# Altium project ELE_MODULE.PrjPcb
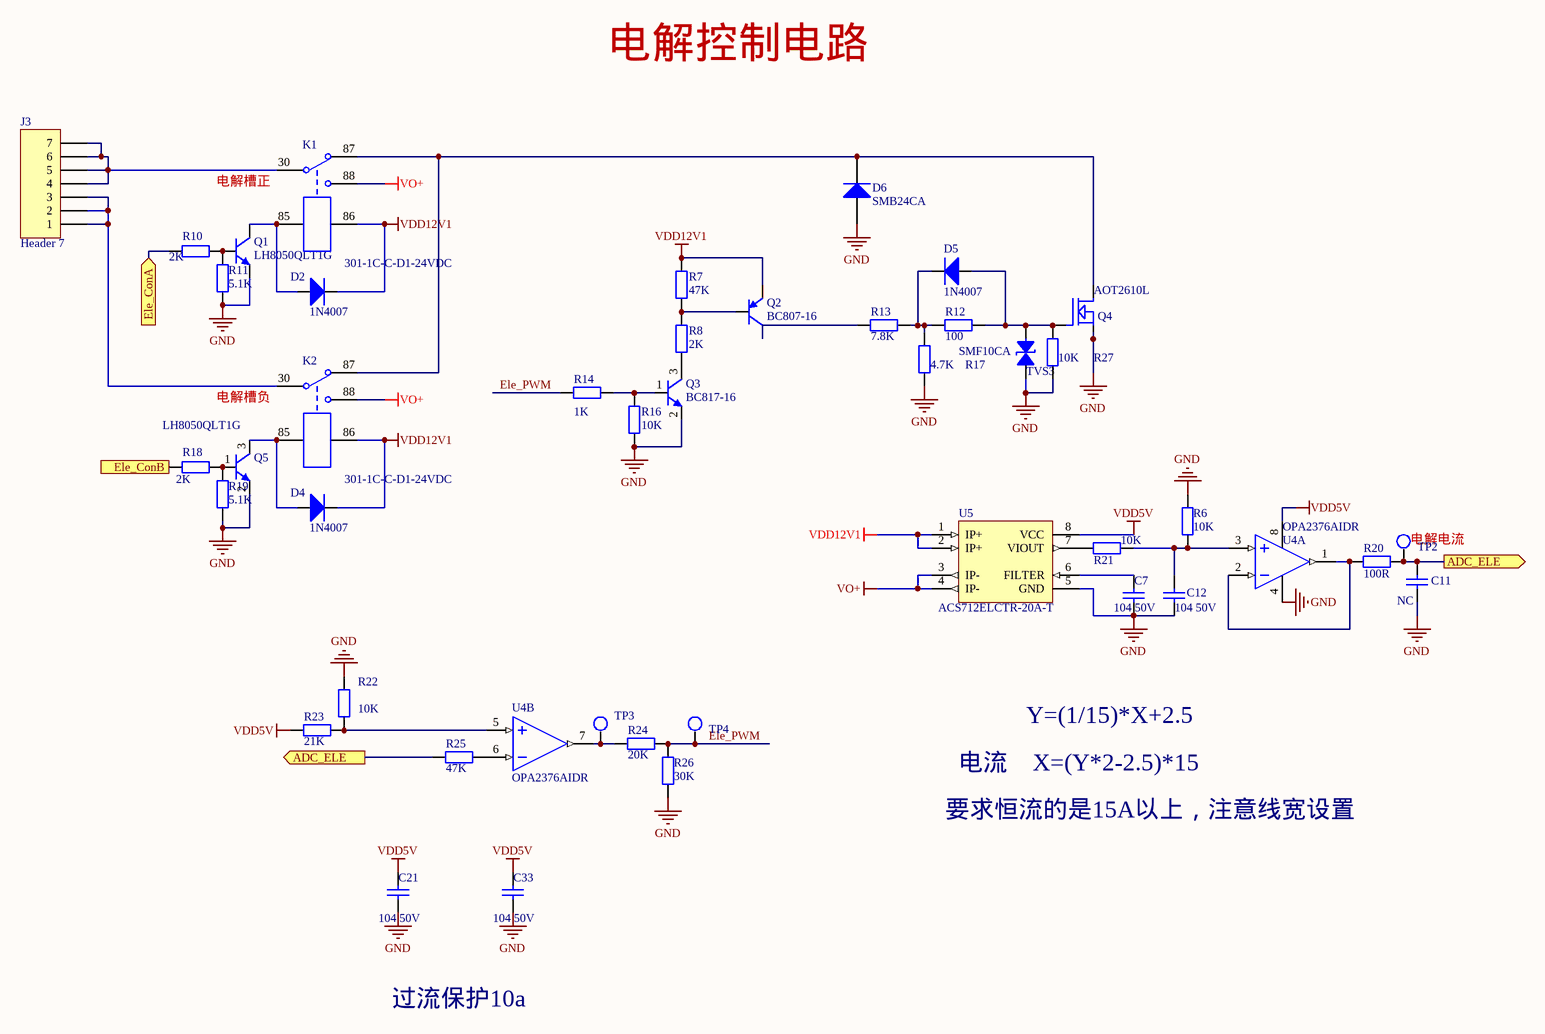
[diagram p0: 07_EL_CON.SchDoc]
2 sheets, 57 parts. Net scope: global (net labels, ports and power ports of the same name join across sheets).
Board file: PCB1.PcbDoc
Sheets:
  07_EL_CON.SchDoc
  com.SchDoc

## Sheet 07_EL_CON.SchDoc
size A3

### Parts
C7  104 50V  [SMD-0603C]
C11  NC  [SMD-0603C]
C12  104 50V  [SMD-0603C]
C21  104 50V  [SMD-0603C]
C33  104 50V  [SMD-0603C]
D2  1N4007  [DO-214-AC]
D4  1N4007  [DO-214-AC]
D5  1N4007  [DO-214-AC]
D6  SMB24CA  [SMB]
J3  Header 7  [VH-AW-3.96*7P]
K1  301-1C-C-D1-24VDC  [301-1C-C-R1-24VDC]
K2  301-1C-C-D1-24VDC  [301-1C-C-R1-24VDC]
Q1  LH8050QLT1G  [SOT-23]
Q2  BC807-16  [SOT-23]
Q3  BC817-16  [SOT-23]
Q4  AOT2610L  [to220]
Q5  LH8050QLT1G  [SOT-23]
R6  10K  [SMD-0603]
R7  47K  [SMD-0603]
R8  2K  [SMD-0603]
R10  2K  [SMD-0603]
R11  5.1K  [SMD-0603]
R12  100  [SMD-0603]
R13  7.8K  [SMD-0603]
R14  1K  [SMD-0603]
R16  10K  [SMD-0603]
R17  4.7K  [SMD-0603]
R18  2K  [SMD-0603]
R19  5.1K  [SMD-0603]
R20  100R  [SMD-0603]
R21  10K  [SMD-0603]
R22  10K  [SMD-0603]
R23  21K  [SMD-0603]
R24  20K  [SMD-0603]
R25  47K  [SMD-0603]
R26  30K  [SMD-0603]
R27  10K  [SMD-0603]
TP2  TPS  [tpd]  (value not drawn)
TP3  TPS  [tpd]  (value not drawn)
TP4  TPS  [tpd]  (value not drawn)
TVS3  SMF10CA  [SOD-123]
U4  OPA2376AIDR  [SO-8]  (parts A,B of 2)
U5  ACS712ELCTR-20A-T  [SO-8]

### Ports
ADC_ELE (out), Ele_ConA (in), Ele_ConB (in)

### Nets
GND: C7.2 C11.1 C12.2 C21.1 C33.1 D6.1(A) Q1.2(E) Q3.2(E) Q4.3(S) Q5.2(E) R6.1 R11.1 R16.1 R17.2 R19.1 R22.2 R26.2 R27.2 TVS3.1(A) U4.4(V-) U5.5(GND)
VDD5V: C21.2 C33.2 R23.2 U4.8(V+) U5.8(VCC)
VDD12V1: D2.2(K) D4.2(K) K1.86 K2.86 Q2.2(E) R7.2 U5.1(IP+) U5.2(IP+)
VO+: K1.88 K2.88 U5.3(IP-) U5.4(IP-)
Ele_PWM: R14.2 R24.1 R26.1 TP4.1
NetC7_1: C7.1 U5.6(FILTER)
NetC11_2: C11.2 R20.1 R25.2 TP2.1 ; port ADC_ELE
NetC12_1: C12.1 R6.2 R21.1 U4.3(IN1+)
NetD2_1: D2.1(A) K1.85 Q1.3(C)
NetD4_1: D4.1(A) K2.85 Q5.3(C)
NetD5_1: D5.1(A) Q4.1(G) R12.2 R27.1 TVS3.2(B)
NetD5_2: D5.2(K) R12.1 R13.1 R17.1
NetD6_2: D6.2(K) K1.87 K2.87 Q4.2(D)
NetJ3_1: J3.1 J3.2 J3.3 K2.30
NetJ3_4: J3.4 J3.5 J3.6 J3.7 K1.30
NetQ1_1: Q1.1(B) R10.2 R11.2
NetQ2_1: Q2.1(B) R7.1 R8.2
NetQ2_3: Q2.3(C) R13.2
NetQ3_1: Q3.1(B) R14.1 R16.2
NetQ3_3: Q3.3(C) R8.1
NetQ5_1: Q5.1(B) R18.2 R19.2
NetR10_1: R10.1 ; port Ele_ConA
NetR18_1: R18.1 ; port Ele_ConB
NetR20_2: R20.2 U4.1(OUT1) U4.2(IN1-)
NetR21_2: R21.2 U5.7(VIOUT)
NetR22_1: R22.1 R23.1 U4.5(IN2+)
NetR24_2: R24.2 TP3.1 U4.7(OUT2)
NetR25_1: R25.1 U4.6(IN2-)

### Notes on the sheet
- 电解控制电路
- 电解槽正
- 电解槽负
- (near TP2) 电解电流
- Y=(1/15)*X+2.5
- 电流
- X=(Y*2-2.5)*15
- 要求恒流的是15A以上，注意线宽设置
- 过流保护10a

### Library data of the parts
C7 = C: 贴片电容 10%
C11 C12 = CAP4: 贴片电容 10%
C21 C33 = CAP4: 贴片电容 20%
D2 D4 D5 = DIODE2: 贴片二极管
D6 = DIODE
J3 = Header 7: Header, 7-Pin; LatestRevisionDate: 17-Jul-2002; LatestRevisionNote: Re-released for DXP Platform.; Publisher: Altium Limited
K1 K2 = JDQ1: 5V 继电器
Q1 Q3 Q5 = NPN-1: 三极管
Q2 = PNP
Q4 = SI7860
R6 R21 = RES0: 贴片电阻 1%
R7 R8 R12-R14 R16 R17 R22-R27 = RES-SOP: 贴片电阻 5%
R10 R11 R18 R19 = RES2: 贴片电阻 5%
R20 = RES0: 贴片电阻 5%
TVS3 = TVS-1: TVS 10V
U4 = LM358: 运算放大器
U5 = ACS712: HALL 20A 电流传感器

## Sheet com.SchDoc
size A4
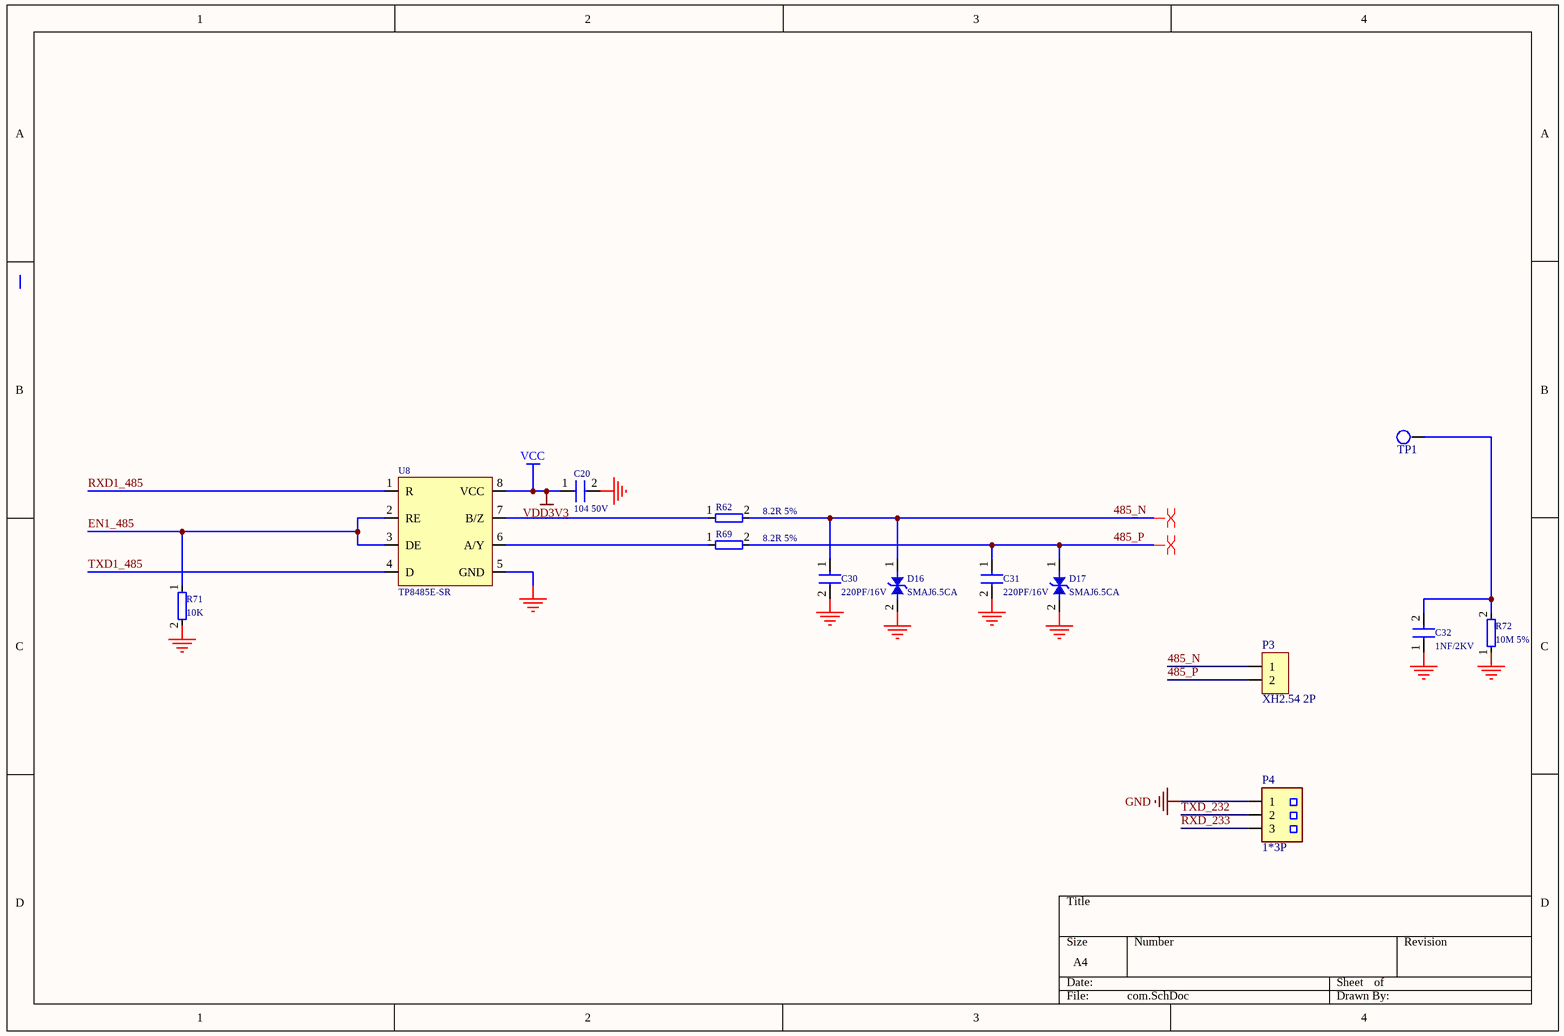
[diagram p1: com.SchDoc]

### Parts
C20  104 50V  [0603C]
C30  220PF/16V  [0603C]
C31  220PF/16V  [0603C]
C32  1NF/2KV  [1206C]
D16  SMAJ6.5CA  [SMA]
D17  SMAJ6.5CA  [SMA]
P3  XH2.54 2P  [SIP-2A]
P4  1*3P  [3X2.54MMZ2]
R62  8.2R 5%  [0603R]
R69  8.2R 5%  [0603R]
R71  10K  [0603R]
R72  10M 5%  [1206r]
TP1  TPS  [tpd]  (value not drawn)
U8  TP8485E-SR  [SO-8]

### Nets
GND: C20.2 C30.2 C31.2 C32.1 D16.2 D17.2 P4.1 R71.2 R72.1 U8.5(GND)
VCC: C20.1 U8.8(VCC)  [also labelled VDD3V3]
485_N: C30.1 D16.1 P3.1 R62.2
485_P: C31.1 D17.1 P3.2 R69.2
EN1_485: R71.1 U8.2(RE) U8.3(DE)
RXD1_485: U8.1(R)
RXD_233: P4.3
TXD1_485: U8.4(D)
TXD_232: P4.2
NetC32_2: C32.2 R72.2 TP1.1
NetR62_1: R62.1 U8.7(B/Z)
NetR69_1: R69.1 U8.6(A/Y)

### Layout directives
differential pair: 485_N, 485_P

### Library data of the parts
C20 C30-C32 = CAP
D16 D17 = D_ESD
P3 = SIP-2: XH2.54 2P 直插
P4 = HDR1*3
R62 R69 R71 R72 = RES

## Nets that join several sheets
GND: 07_EL_CON (21 pins), com (10 pins)